# Altium schematic sheet traversal_v1.SchDoc
size A3; SheetNumber: 1; SheetTotal: 1
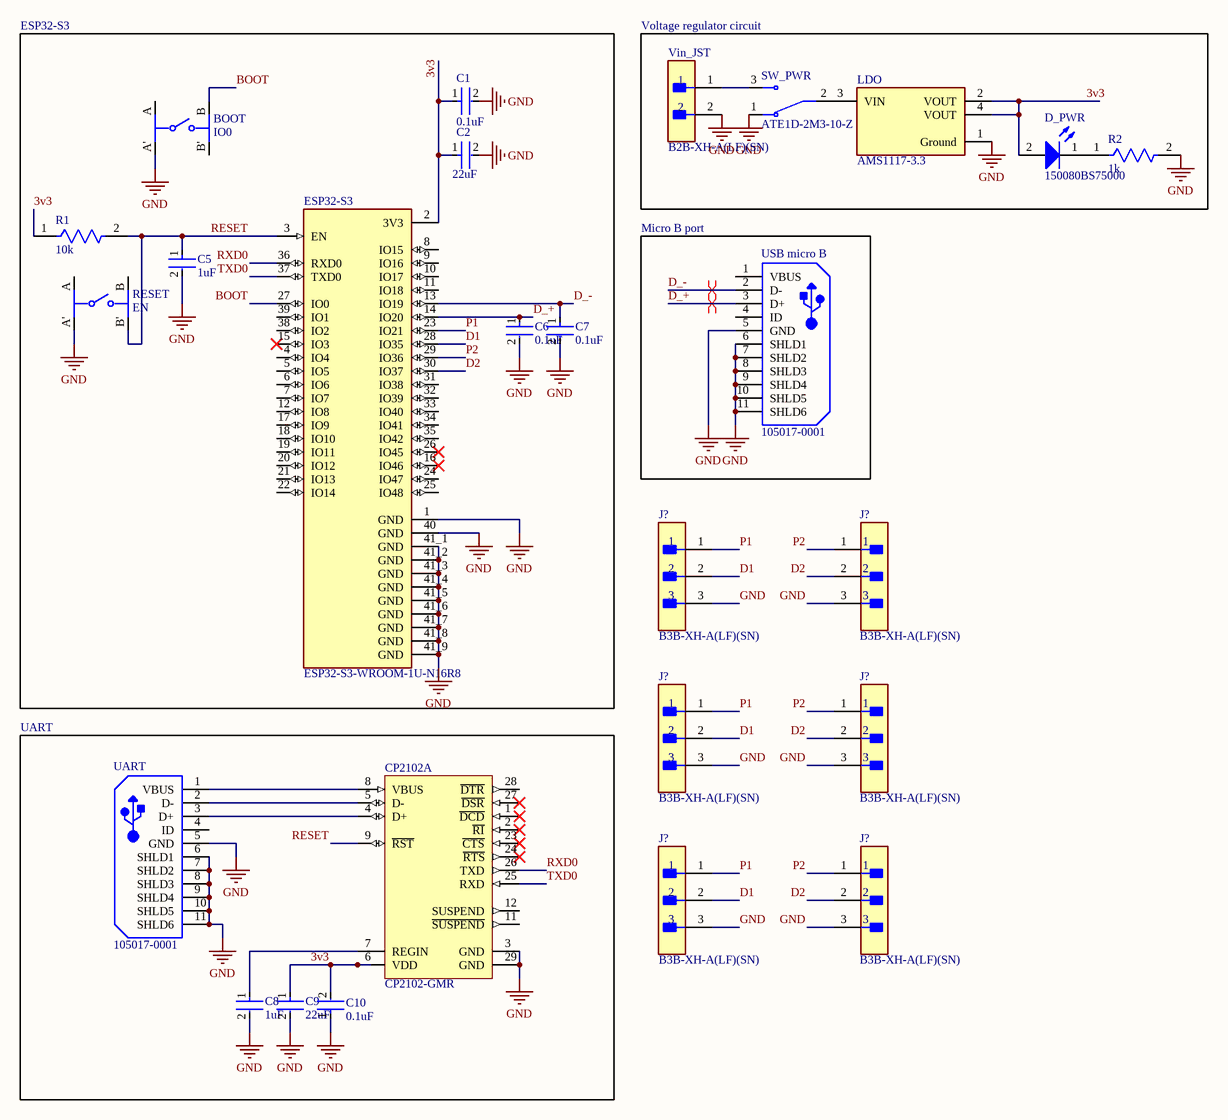
[diagram p0: traversal_v1.SchDoc]

## Parts
(Parts that share a designator on the sheet are numbered #1, #2 ... from top to bottom, then left to right.)
BOOT  IO0  [FP-EVQ-PAC07K-MFG]
C1  0.1uF  [FP-0805-L_2_01_0_2-W_1_25-IPC_C]
C2  22uF  [FP-0805-L_2_01_0_2-W_1_25-IPC_B]
C5  1uF  [FP-0805-L_2_01_0_2-W_1_25-IPC_B]
C6  0.1uF  [FP-0805-L_2_01_0_2-W_1_25-IPC_C]
C7  0.1uF  [FP-0805-L_2_01_0_2-W_1_25-IPC_C]
C8  1uF  [FP-0805-L_2_01_0_2-W_1_25-IPC_B]
C9  22uF  [FP-0805-L_2_01_0_2-W_1_25-IPC_B]
C10  0.1uF  [FP-0805-L_2_01_0_2-W_1_25-IPC_C]
CP2102  CP2102-GMR  [SLAB-QFN-28-3125x3125TP_M]  (part A of 2)
D_PWR  150080BS75000  [WL-SMCW_0805_150080xx75000]
ESP32-S3  ESP32-S3-WROOM-1U-N16R8  [XCVR_ESP32-S3-WROOM-1U-N16R8]
J?#1  B3B-XH-A(LF)(SN)  [FP-B3B-XH-A_LF_SN-MFG]
J?#2  B3B-XH-A(LF)(SN)  [FP-B3B-XH-A_LF_SN-MFG]
J?#3  B3B-XH-A(LF)(SN)  [FP-B3B-XH-A_LF_SN-MFG]
J?#4  B3B-XH-A(LF)(SN)  [FP-B3B-XH-A_LF_SN-MFG]
J?#5  B3B-XH-A(LF)(SN)  [FP-B3B-XH-A_LF_SN-MFG]
J?#6  B3B-XH-A(LF)(SN)  [FP-B3B-XH-A_LF_SN-MFG]
LDO  AMS1117-3.3  [FP-AMS1117-IPC_C]
R1  10k  [FP-CRCW0805-e3-IPC_A]
R2  1k  [FP-CRCW0805-e3-MFG]
RESET  EN  [FP-EVQ-PAC07K-MFG]
SW_PWR  ATE1D-2M3-10-Z  [SW_ATE1D-2M3-10-Z]
UART  105017-0001  [USB-MICRO-B_V]
USB_micro_B  105017-0001  [USB-MICRO-B_V]
Vin_JST  B2B-XH-A(LF)(SN)  [FP-B2B-XH-A_LF_SN-MFG]

## Blocks framed on the sheet
ESP32-S3: BOOT C1 C2 C5-C7 ESP32-S3 R1 RESET
Voltage regulator circuit: D_PWR LDO R2 SW_PWR Vin_JST
Micro B port: USB_micro_B
UART: C8-C10 CP2102 UART

## Nets
GND: BOOT.A' C1.2 C2.2 C5.2 C6.2 C7.2 C8.2 C9.2 C10.1 CP2102.3(GND) CP2102.29(GND) ESP32-S3.1(GND) ESP32-S3.40(GND) ESP32-S3.41_1(GND) ESP32-S3.41_2(GND) ESP32-S3.41_3(GND) ESP32-S3.41_4(GND) ESP32-S3.41_5(GND) ESP32-S3.41_6(GND) ESP32-S3.41_7(GND) ESP32-S3.41_8(GND) ESP32-S3.41_9(GND) J?#1.3 J?#2.3 J?#3.3 J?#4.3 J?#5.3 J?#6.3 LDO.1(Ground) R2.2 RESET.A' SW_PWR.1 UART.5(GND) UART.6(SHLD1) UART.7(SHLD2) UART.8(SHLD3) UART.9(SHLD4) UART.10(SHLD5) UART.11(SHLD6) USB_micro_B.5(GND) USB_micro_B.6(SHLD1) USB_micro_B.7(SHLD2) USB_micro_B.8(SHLD3) USB_micro_B.9(SHLD4) USB_micro_B.10(SHLD5) USB_micro_B.11(SHLD6) Vin_JST.2
3v3: C1.1 C2.1 C9.1 C10.2 CP2102.6(VDD) D_PWR.2(A) ESP32-S3.2(3V3) LDO.2(VOUT) LDO.4(VOUT) R1.1
BOOT: BOOT.B ESP32-S3.27(IO0)
D1: ESP32-S3.28(IO35) J?#1.2 J?#3.2 J?#5.2
D2: ESP32-S3.30(IO37) J?#2.2 J?#4.2 J?#6.2
D_+: C6.1 ESP32-S3.14(IO20) USB_micro_B.3(D+)
D_-: C7.1 ESP32-S3.13(IO19) USB_micro_B.2(D-)
P1: ESP32-S3.23(IO21) J?#1.1 J?#3.1 J?#5.1
P2: ESP32-S3.29(IO36) J?#2.1 J?#4.1 J?#6.1
RESET: C5.1 CP2102.9(~{RST}) ESP32-S3.3(EN) R1.2 RESET.B'
RXD0: CP2102.26(TXD) ESP32-S3.36(RXD0)
TXD0: CP2102.25(RXD) ESP32-S3.37(TXD0)
NetC8_1: C8.1 CP2102.7(REGIN)
NetCP2102_4: CP2102.4(D+) UART.3(D+)
NetCP2102_5: CP2102.5(D-) UART.2(D-)
NetCP2102_8: CP2102.8(VBUS) UART.1(VBUS)
NetD_PWR_1: D_PWR.1(K) R2.1
NetLDO_3: LDO.3(VIN) SW_PWR.2
NetSW_PWR_3: SW_PWR.3 Vin_JST.1

Not connected (* = marked no-connect by the designer): BOOT A B'; CP2102 1(~{DCD})* 2(~{RI})* 11(~{SUSPEND}) 12(SUSPEND) 23(~{CTS})* 24(~{RTS})* 27(~{DSR})* 28(~{DTR}); ESP32-S3 4(IO4) 5(IO5) 6(IO6) 7(IO7) 8(IO15) 9(IO16) 10(IO17) 11(IO18) 12(IO8) 15(IO3)* 16(IO46)* 17(IO9) 18(IO10) 19(IO11) 20(IO12) 21(IO13) 22(IO14) 24(IO47) 25(IO48) 26(IO45)* 31(IO38) 32(IO39) 33(IO40) 34(IO41) 35(IO42) 38(IO2) 39(IO1); RESET A B; UART 4(ID); USB_micro_B 1(VBUS) 4(ID)

## Layout directives
differential pair: D_+, D_-

## Library data of the parts
BOOT RESET = CMP-00287-39841884-1: EVQ-PAC07K Switch Tactile N.O. SPST Round Button PC Pins 0.02A 15VDC 1N Thru-Hole Bulk; Max Current Rating: 20mA; Mechanical Life: 100kcycles; Contact Resistance: 50mΩ; Number of Positions: 2; Voltage Rating (DC): 15V; Actuator Length: 3.1mm; Illumination Type: Illuminated, Non-Illuminated; Switch Travel: 250µm; Switch Function: Off-Mom; Contact Plating: Gold, Silver; Max Operating Temperature: 70°C; Depth: 7.8mm; Min Operating Temperature: -20°C; Length: 6mm; Radiation Hardening: No; Mount: Through Hole; Operating Force: 1N; Height: 7mm; REACH SVHC: Unknown; Lead Free: Lead Free; Current Rating: 20mA; RoHS: Compliant; Contact Current Rating: 20mA; Width: 6mm; NexarPartId: 39841884; Electrical Life: 100kcycles; Termination: PC Pins; Packaging: Bulk; Life (Cycles): 100kcycles; Max Voltage Rating (DC): 15V; Orientation: Straight; Throw Configuration: SPST; Color: Black
C1 C6 C7 C10 = CMP-2000-05016-2: General Purpose Ceramic Capacitor, 0805, 100nF, 10%, X7R, 0.15, 50V; Dissipation Factor: 2.5%; Insulation Resistance: 100GR; Voltage Rating (DC): 50V; Package Quantity: 4000; Tolerance: 10%; Voltage Rating: 50V; Dielectric: X7R; Case/Package: 0805; Lead Free: Lead Free; Dielectric Material: Ceramic; Thickness: 0.037inch; Weight: 0.001411oz; Max Operating Temperature: 125°C; REACH SVHC: No SVHC; Mount: Surface Mount; RoHS Compliant: Yes; Depth: 1.25mm; Height: 0.5mm; Case Code (Metric): 2012; Length: 2mm; Termination: Standard; Case Code (Imperial): 0805; Number of Pins: 2; Voltage: 50V; Radiation Hardening: No; Min Operating Temperature: -55°C; Capacitance: 100nF; Width: 1.2mm; Series: MLCC X7R; Packaging: Cut Tape
C2 C9 = CMP-1036-04939-3: General Purpose Ceramic Capacitor, 0805, 22uF, 20%, X5R, 15%, 6.3V; Dissipation Factor: 12.5%; Insulation Resistance: 10GR; Dielectric Material: Ceramic; Tolerance: 20%; Max Operating Temperature: 85°C; Min Operating Temperature: -55°C; Package Quantity: 1; Termination: SMD/SMT; Voltage Rating: 6.3V; Voltage: 6.3V; Width: 0.049inch; Mount: Surface Mount; Thickness: 0.055inch; RoHS Compliant: Yes; Lead Free: Lead Free; Packaging: Tape and Reel; Capacitance: 22uF; Depth: 1.25mm; Radiation Hardening: No; Voltage Rating (DC): 6.3V; Number of Pins: 2; Dielectric: X5R; Case/Package: 0805; Length: 2.01mm; Case Code (Metric): 2012; REACH SVHC: No SVHC; Case Code (Imperial): 0805; Height: 1.4mm
C5 C8 = CMP-2007-04599-2: General Purpose Ceramic Capacitor, 0805, 1uF, 10%, X7R, 15%, 25V; Temperature Coefficient: 30ppm/°C; Packaging: Tape and Reel; Min Operating Temperature: -55°C; Contact Plating: Tin; Tolerance: 10%; Radiation Hardening: No; Height: 1.4mm; Case Code (Metric): 2012; Mount: Surface Mount; Lead Free: Lead Free; REACH SVHC: No SVHC; Features: Soft Termination; Voltage Rating (DC): 25V; Length: 2.01mm; Capacitance: 1uF; Thickness: 0.055inch; Series: FLEXITERM®; Case/Package: 0805; Depth: 1.25mm; Number of Pins: 2; Max Operating Temperature: 125°C; Package Quantity: 1; Dielectric: X7R; Construction: Flat; Width: 1.25mm; Case Code (Imperial): 0805; Voltage: 25V; RoHS Compliant: Yes; Termination: SMD/SMT; Voltage Rating: 25V
CP2102 = CMP-2000-04924-1: Single-Chip USB to URAT Bridge, 3.3 V, -40 to 85 degC, 28-Pin QFN, RoHS, Tape and Reel; Manufacturer: Silicon Labs; Interface Circuit Standard 1: RS-232; Transmitter and Receiver FIFO Counter: No; Supply Current: 26mA; Operating Supply Voltage (Min): 3V; Operating Supply Voltage (Typ): 3.3V; Data Rate: 1000kbps; Operating Supply Voltage (Max): 3.6V; Number of Channels: 1; Package URL: http://www.silabs.com/Support%20Documents/TechnicalDocs/C8051T61x.pdf; Operating Temperature (Max): 85C; Datasheet URL: http://www.mouser.com/ds/2/368/CP2102-9-247052.pdf; Operating Temperature Classification: Industrial; Operating Temperature (Min): -40C; Package Description: 28-Pin Quad-Flat No-Leads Package, Body 5 x 5 mm, Pitch 0.5 mm; Manufacturer URL: http://www.silabs.com/; Rad Hardened: No; Package Reference: QFN-28; Pin Count: 28; Packaging: TapeandReel; Mounting: SurfaceMount; Package Type: QFNEP; Datasheet Version: Rev. 1.6, 12/2013
D_PWR = CMP-1426-00008-7: Led, Blue, 470 Nm, 3.2 V, 30 Ma, 145 Mcd Rohs Compliant: Yes; Dominant Wavelength: 470nm; Max Junction Temperature (Tj): 95°C; Power Dissipation: 105mW; Peak Wavelength: 465nm; Max Reverse Voltage (DC): 5V; Forward Current: 100mA; Test Current: 20mA; Luminous Intensity: 145mcd; Lens Style: Clear, Rectangular; Viewing Angle: 140°; Forward Voltage: 3.2V; Color: Blue; Height: 700µm; Case Code (Imperial): 0805; Width: 1.25mm; REACH SVHC: Unknown; Case/Package: 0805; Lead Free: Lead Free; Mount: Surface Mount; Packaging: Tape and Reel; RoHS: Compliant; Reverse Voltage: 5V; Min Operating Temperature: -40°C; Case Code (Metric): 2012; Wavelength: 470nm; Max Operating Temperature: 85°C; Length: 2mm
ESP32-S3 = ESP32-S3-WROOM-1U-N16R8: Bluetooth, WiFi 802.11b/g/n, Bluetooth v5.0 Transceiver Module 2.4GHz Antenna Not Included, U.FL Surface Mount; MF: Espressif Systems; Package: None; Price: None; Value: *; SnapEDA_Link: https://www.snapeda.com/parts/ESP32-S3-WROOM-1U-N16R8/Espressif+Systems/view-part/?ref=snap; MP: ESP32-S3-WROOM-1U-N16R8; Availability: Unavailable; Check_prices: https://www.snapeda.com/parts/ESP32-S3-WROOM-1U-N16R8/Espressif+Systems/view-part/?ref=eda
J?#1-J?#6 = CMP-17439-000014-3: CONN HEADER VERT 3POS 2.5MM; Max Voltage Rating (DC): 250V; Number of Positions: 3; Current Rating: 3A; Gender: Male; Wire/Cable Gauge: 22AWG; Contact Resistance: 20mR; Insulation Resistance: 1GR; Insulation Material: Nylon; Contact Plating: Tin; Depth: 5.75mm; Contact Type: Male Pin; Max Operating Temperature: 85°C; Insulation Color: Natural; Voltage Rating (AC): 250V; Color: Natural; Connector Type: Header; Orientation: Straight; Fastening Type: Detent; Housing Color: White; Min Operating Temperature: -25°C; Termination: Solder; Voltage Rating: 250V; Series: XH; Pitch: 2.5mm; Contact Shape: Square; Number of Rows: 1; Lead Free: Lead Free; Packaging: Bulk; Mount: Through Hole; Flammability Rating: UL94 V-0; Max Voltage Rating (AC): 250V; REACH SVHC: No SVHC; Housing Material: Polyamide; Contact Material: Brass; Lead Pitch: 2.5mm; Contact Finish - Mating: TIN; Length: 9.9mm; Max Current Rating: 3A; Number of Contacts: 3
LDO = CMP-209535-000001-1: LDO Voltage Regulators 1A, 3.3V; Manufacturer: Advanced Monolithic Systems; Dropout Voltage: 1.1V; Output Type: Fixed; Nominal Supply Current: 5mA; Max Power Dissipation: 1.2W; Max Supply Voltage: 15V; Number Of Outputs: 1; Standoff Height: 0.64mm; Max Junction Temp: +125°C; Height: 1.8mm; Package: AMS1117; Device Class L2: Power Management ICs; ComponentLink2Description: Datasheet; ComponentLink2URL: http://www.advanced-monolithic.com/pdf/ds1117.pdf; Category: IC; RoHS: TRUE; Automotive: No; Device Class L1: Integrated Circuits (ICs); Output Current: 1A; Device Class L3: Voltage Regulators - Linear; Temperature: -40°C to +125°C; Output Voltage: 3.3V; Manufacturer Part Number: AMS1117-3.3; Temperature Range Low: -40°C; Octopart: https://octopart.com/ams1117-3.3-advanced+monolithic+systems-25899300; Lead Free: Yes; Ipc Land Pattern Name: SOT229P700X180-4; Temperature Range High: +125°C
R1 = CMP-2001-04908-2: RES Thick Film, 10kΩ, 1%, 0.125W, 100ppm/°C, 0805; Resistance: 10kR; Voltage Rating (DC): 150V; Power Rating: 125mW; Weight: 0.000194oz; Package Quantity: 5000; Military Standard: Not; Max Operating Temperature: 155°C; Temperature Coefficient: 100ppm/°C; Contact Plating: Tin; Width: 1.25mm; Height: 0.45mm; Radiation Hardening: No; Tolerance: 1%; Min Operating Temperature: -55°C; Voltage Rating: 150V; Length: 2mm; Depth: 1.25mm; Termination: SMD/SMT; Packaging: Tape and Reel; Case/Package: 0805; Case Code (Metric): 2012; Lead Free: Lead Free; Case Code (Imperial): 0805; Composition: Thick Film
R2 = CMP-2001-03607-2: RES Thick Film, 1.2kΩ, 1%, 0.125W, 100ppm/°C, 0805; Max Power Dissipation: 125mW; Voltage Rating (DC): 150V; Resistance: 1.2kR; Military Standard: Not; Termination: SMD/SMT; Package Quantity: 10; Min Operating Temperature: -55°C; Weight: 0.000194oz; Width: 0.049inch; Voltage Rating: 150V; Temperature Coefficient: 100ppm/°C; Case Code (Imperial): 0805; Packaging: Tape and Reel; Composition: Thick Film; Lead Free: Lead Free; Number of Terminations: 2; Depth: 1.25mm; Power Rating: 125mW; Tolerance: 1%; Radiation Hardening: No; Length: 2mm; Case Code (Metric): 2012; Max Operating Temperature: 155°C; Height: 0.45mm; Features: Automotive AEC-Q200; Contact Plating: Tin; Case/Package: 0805
SW_PWR = ATE1D-2M3-10-Z: Toggle Switch SPDT Through Hole; MF: Nidec Copal Electronics; Purchase-URL: https://pricing.snapeda.com/search/part/ATE1D-2M3-10-Z/?ref=eda; Package: None; Check_prices: https://www.snapeda.com/parts/ATE1D-2M3-10-Z/Nidec+Copal+Electronics/view-part/?ref=eda; Digi-Key_Part_Number: 563-1157-ND; Value: *; MP: ATE1D-2M3-10-Z; SnapEDA_Link: https://www.snapeda.com/parts/ATE1D-2M3-10-Z/Nidec+Copal+Electronics/view-part/?ref=snap
UART USB_micro_B = CMP-2000-05827-1: Micro-USB B Receptacle, Right Angle, Bottom Mount, Surface Mount, with Solder Tabs, -30 to 85 degC, 5-Pin USB, RoHS, Tape and Reel; Manufacturer: Molex; Featured Product: Micro-USBConnectorsUSBConnectors; Other Names: WM1399DKR; Package Version: Rev. F, 12/2012; Number of Contacts: 5; Connector Type: USB-microB; Catalog Drawings: 1050170001; 3D Model: 105017-0001.stp; Mating Products: WM17145-ND-CABLEMICROUSBBTOSTDA1.0MWM17147-ND-CABLEMICROUSBBTOSTDA2.0MWM17146-ND-CABLEMICROUSBBTOSTDA1.5M; PCN Assembly/Origin: ResinSupplier21/Oct/2015; Voltage - Max: 30V; Online Catalog: Molex-MicroUSB; Manufacturer URL: http://www.molex.com/; Package Description: 5-Leads USB, Micro B, Body 7.5 x 5 mm, Pitch 0.65 mm; Datasheet URL: http://www.molex.com/elqNow/elqRedir.htm?ref=http://www.molex.com/webdocs/datasheets/pdf/en-us/1050170001_IO_CONNECTORS.pdf; Ingress Protection: -; Datasheet Version: 03/2016; Mounting Type: BoardCutout,SurfaceMount,RightAngle; Circuits: 5; Standard Package: 1; Package Reference: MICRO-B; Package URL: http://www.molex.com/pdm_docs/sd/1050170001_sd.pdf; Category: Connectors,Interconnects; Series: -; RoHS Information: 1050170001CertofCompliance; Features: Shielded,SolderRetention; Family: USB,DVI,HDMIConnectors; Specifications: -; Gender: Receptacle; Packaging: Digi-Reel®; Mounting Technology: SurfaceMount
Vin_JST = CMP-2000-05888-3: CONN HEADER VERT 2POS 2.5MM; Current Rating: 3A; Voltage Rating: 250V; Number of Contacts: 2; Contact Resistance: 20mR; Wire/Cable Gauge: 22AWG; Insulation Resistance: 1GR; Connector Type: Male Pin; Packaging: Bulk; Contact Material: Brass; Lead Free: Lead Free; Orientation: Straight; Contact Plating: Tin; Max Current Rating: 3A; Termination: Solder; Fastening Type: Detent; Depth: 5.75mm; Housing Material: Polyamide; REACH SVHC: No SVHC; Series: XH; Voltage Rating (AC): 250V; Number of Positions: 2; Color: Natural; Contact Type: Male Pin; Max Voltage Rating (DC): 250V; Pitch: 2.5mm; Lead Pitch: 2.5mm; Mount: Through Hole; Max Operating Temperature: 85°C; Length: 7.4mm; Max Voltage Rating (AC): 250V; Min Operating Temperature: -25°C; Number of Rows: 1; Housing Color: White